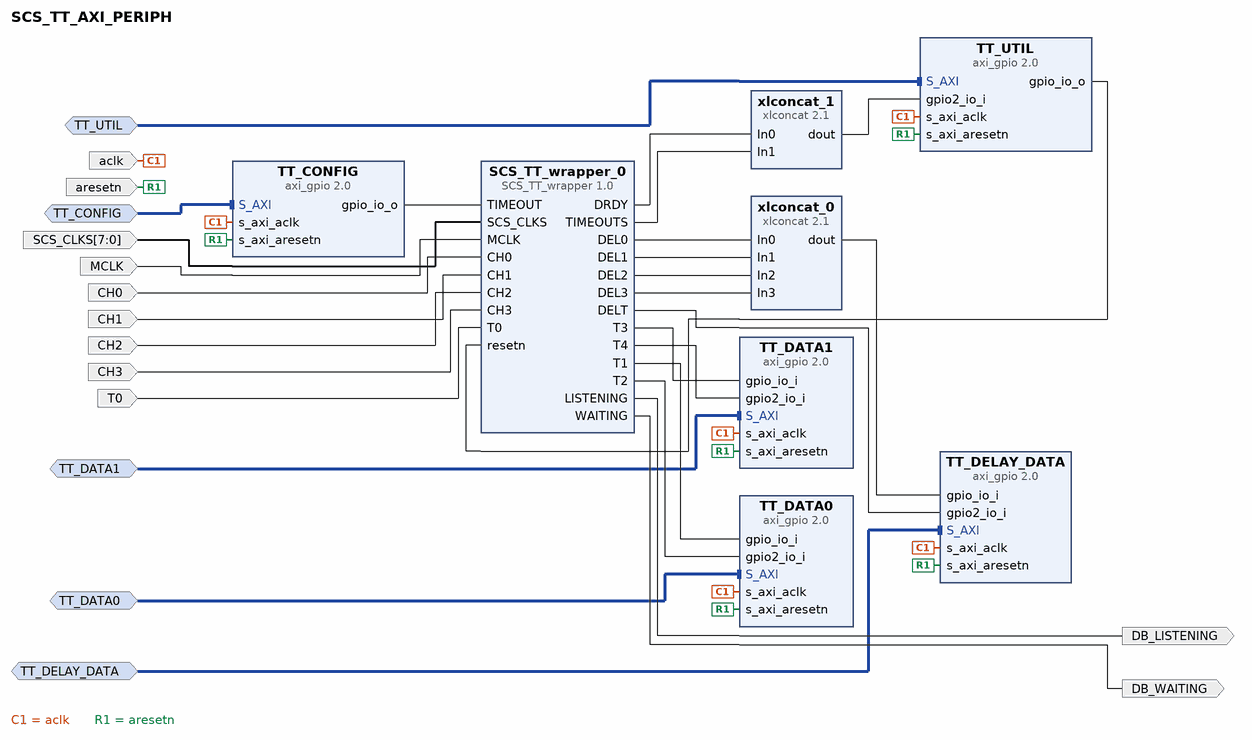
[diagram p0: block diagram of the top level]
# Vivado block design SCS_TT_AXI_PERIPH, xc7z020clg400-1, Vivado 2019.1
create_bd_design SCS_TT_AXI_PERIPH

create_bd_intf_port -mode Slave -vlnv xilinx.com:interface:aximm_tlm:1.0 TT_DATA0
create_bd_intf_port -mode Slave -vlnv xilinx.com:interface:aximm_tlm:1.0 TT_DATA1
create_bd_intf_port -mode Slave -vlnv xilinx.com:interface:aximm_tlm:1.0 TT_DELAY_DATA
create_bd_intf_port -mode Slave -vlnv xilinx.com:interface:aximm_tlm:1.0 TT_UTIL
create_bd_intf_port -mode Slave -vlnv xilinx.com:interface:aximm_tlm:1.0 TT_CONFIG
create_bd_port -dir O -type data DB_LISTENING
create_bd_port -dir O -type data DB_WAITING
create_bd_port -dir I -from 7 -to 0 -type clk SCS_CLKS
set_property -dict {CONFIG.FREQ_HZ 460000000} [get_bd_ports SCS_CLKS]
create_bd_port -dir I -type clk MCLK
set_property -dict {CONFIG.FREQ_HZ 460000000} [get_bd_ports MCLK]
create_bd_port -dir I -type data CH0
create_bd_port -dir I -type data CH1
create_bd_port -dir I -type data CH2
create_bd_port -dir I -type data CH3
create_bd_port -dir I -type data T0
create_bd_port -dir I -type clk aclk
set_property -dict {CONFIG.FREQ_HZ 100000000} [get_bd_ports aclk]
create_bd_port -dir I -type rst aresetn

create_bd_cell -type ip -vlnv cri.nz:user:SCS_TT_wrapper:1.0 SCS_TT_wrapper_0
create_bd_cell -type ip -vlnv xilinx.com:ip:axi_gpio:2.0 TT_DATA0
set_property -dict {CONFIG.C_ALL_INPUTS 1 CONFIG.C_ALL_INPUTS_2 1 CONFIG.C_IS_DUAL 1} [get_bd_cells TT_DATA0]
create_bd_cell -type ip -vlnv xilinx.com:ip:axi_gpio:2.0 TT_DATA1
set_property -dict {CONFIG.C_ALL_INPUTS 1 CONFIG.C_ALL_INPUTS_2 1 CONFIG.C_IS_DUAL 1} [get_bd_cells TT_DATA1]
create_bd_cell -type ip -vlnv xilinx.com:ip:axi_gpio:2.0 TT_DELAY_DATA
set_property -dict [list \
  CONFIG.C_ALL_INPUTS 1 \
  CONFIG.C_ALL_INPUTS_2 1 \
  CONFIG.C_GPIO2_WIDTH 8 \
  CONFIG.C_IS_DUAL 1 \
] [get_bd_cells TT_DELAY_DATA]
create_bd_cell -type ip -vlnv xilinx.com:ip:xlconcat:2.1 xlconcat_0
set_property -dict [list \
  CONFIG.IN0_WIDTH 8 \
  CONFIG.IN1_WIDTH 8 \
  CONFIG.IN2_WIDTH 8 \
  CONFIG.IN3_WIDTH 8 \
  CONFIG.NUM_PORTS 4 \
] [get_bd_cells xlconcat_0]
create_bd_cell -type ip -vlnv xilinx.com:ip:axi_gpio:2.0 TT_UTIL
set_property -dict [list \
  CONFIG.C_ALL_INPUTS_2 1 \
  CONFIG.C_ALL_OUTPUTS 1 \
  CONFIG.C_GPIO2_WIDTH 5 \
  CONFIG.C_GPIO_WIDTH 1 \
  CONFIG.C_IS_DUAL 1 \
] [get_bd_cells TT_UTIL]
create_bd_cell -type ip -vlnv xilinx.com:ip:xlconcat:2.1 xlconcat_1
set_property -dict {CONFIG.IN0_WIDTH 1 CONFIG.IN1_WIDTH 4} [get_bd_cells xlconcat_1]
create_bd_cell -type ip -vlnv xilinx.com:ip:axi_gpio:2.0 TT_CONFIG
set_property -dict {CONFIG.C_ALL_OUTPUTS 1} [get_bd_cells TT_CONFIG]

# ---- connections ----

connect_bd_intf_net [get_bd_intf_ports TT_UTIL] [get_bd_intf_pins TT_UTIL/S_AXI]
connect_bd_intf_net [get_bd_intf_ports TT_CONFIG] [get_bd_intf_pins TT_CONFIG/S_AXI]
connect_bd_intf_net -intf_net TT_DATA0_1 [get_bd_intf_ports TT_DATA0] [get_bd_intf_pins TT_DATA0/S_AXI]
connect_bd_intf_net [get_bd_intf_ports TT_DELAY_DATA] [get_bd_intf_pins TT_DELAY_DATA/S_AXI]
connect_bd_intf_net -intf_net TT_DATA1_1 [get_bd_intf_ports TT_DATA1] [get_bd_intf_pins TT_DATA1/S_AXI]
connect_bd_net [get_bd_pins SCS_TT_wrapper_0/T1] [get_bd_pins TT_DATA0/gpio_io_i]
connect_bd_net [get_bd_pins SCS_TT_wrapper_0/T2] [get_bd_pins TT_DATA0/gpio2_io_i]
connect_bd_net [get_bd_pins SCS_TT_wrapper_0/T3] [get_bd_pins TT_DATA1/gpio_io_i]
connect_bd_net [get_bd_pins SCS_TT_wrapper_0/T4] [get_bd_pins TT_DATA1/gpio2_io_i]
connect_bd_net [get_bd_pins SCS_TT_wrapper_0/DEL0] [get_bd_pins xlconcat_0/In0]
connect_bd_net [get_bd_pins SCS_TT_wrapper_0/DEL1] [get_bd_pins xlconcat_0/In1]
connect_bd_net [get_bd_pins SCS_TT_wrapper_0/DEL2] [get_bd_pins xlconcat_0/In2]
connect_bd_net [get_bd_pins SCS_TT_wrapper_0/DEL3] [get_bd_pins xlconcat_0/In3]
connect_bd_net [get_bd_pins xlconcat_0/dout] [get_bd_pins TT_DELAY_DATA/gpio_io_i]
connect_bd_net [get_bd_pins SCS_TT_wrapper_0/DELT] [get_bd_pins TT_DELAY_DATA/gpio2_io_i]
connect_bd_net [get_bd_pins TT_UTIL/gpio_io_o] [get_bd_pins SCS_TT_wrapper_0/resetn]
connect_bd_net [get_bd_pins SCS_TT_wrapper_0/LISTENING] [get_bd_ports DB_LISTENING]
connect_bd_net [get_bd_pins SCS_TT_wrapper_0/WAITING] [get_bd_ports DB_WAITING]
connect_bd_net [get_bd_pins SCS_TT_wrapper_0/DRDY] [get_bd_pins xlconcat_1/In0]
connect_bd_net [get_bd_pins SCS_TT_wrapper_0/TIMEOUTS] [get_bd_pins xlconcat_1/In1]
connect_bd_net [get_bd_pins xlconcat_1/dout] [get_bd_pins TT_UTIL/gpio2_io_i]
connect_bd_net [get_bd_pins TT_CONFIG/gpio_io_o] [get_bd_pins SCS_TT_wrapper_0/TIMEOUT]
connect_bd_net [get_bd_ports SCS_CLKS] [get_bd_pins SCS_TT_wrapper_0/SCS_CLKS]
connect_bd_net [get_bd_ports MCLK] [get_bd_pins SCS_TT_wrapper_0/MCLK]
connect_bd_net -net CH0_1 [get_bd_ports CH0] [get_bd_pins SCS_TT_wrapper_0/CH0]
connect_bd_net -net CH1_1 [get_bd_ports CH1] [get_bd_pins SCS_TT_wrapper_0/CH1]
connect_bd_net -net CH2_1 [get_bd_ports CH2] [get_bd_pins SCS_TT_wrapper_0/CH2]
connect_bd_net -net CH3_1 [get_bd_ports CH3] [get_bd_pins SCS_TT_wrapper_0/CH3]
connect_bd_net -net T0_1 [get_bd_ports T0] [get_bd_pins SCS_TT_wrapper_0/T0]
connect_bd_net [get_bd_ports aclk] \
  [get_bd_pins TT_UTIL/s_axi_aclk] [get_bd_pins TT_CONFIG/s_axi_aclk] [get_bd_pins TT_DATA1/s_axi_aclk] \
  [get_bd_pins TT_DELAY_DATA/s_axi_aclk] [get_bd_pins TT_DATA0/s_axi_aclk]
connect_bd_net [get_bd_ports aresetn] \
  [get_bd_pins TT_DELAY_DATA/s_axi_aresetn] [get_bd_pins TT_DATA1/s_axi_aresetn] [get_bd_pins TT_UTIL/s_axi_aresetn] \
  [get_bd_pins TT_CONFIG/s_axi_aresetn] [get_bd_pins TT_DATA0/s_axi_aresetn]

validate_bd_design
save_bd_design
